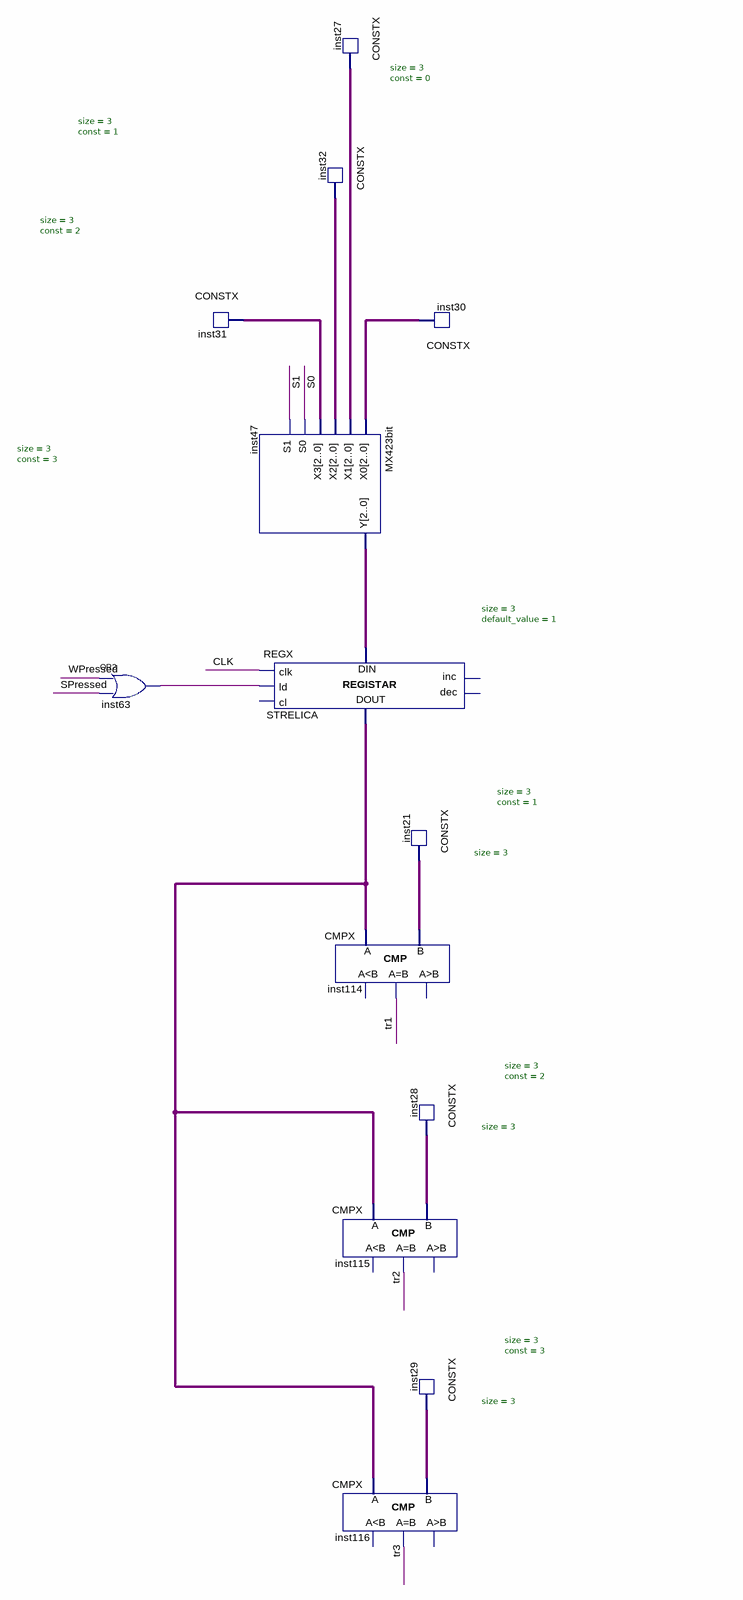
[diagram p0: schematic sheet]
// Quartus schematic ImplementacijaStreliceSema1.bdf as structural Verilog: 13 symbols, 0 pins
module ImplementacijaStreliceSema1 (
);

  wire CLK, inst63_out, S0, S1, SPressed, tr1, tr2, tr3, WPressed;
  wire [2:0] inst21_data, inst27_data, inst28_data, inst29_data, inst30_data, inst31_data, inst32_data,
       inst47_y, STRELICA_data_out;

  or inst63 (inst63_out, WPressed, SPressed);
  CONSTX #(.size(3), .\const (3)) inst31 (.data(inst31_data));
  MX423bit inst47 (
    .X0(inst30_data), .X1(inst27_data), .X2(inst32_data), .X3(inst31_data), .S0(S0), .S1(S1), .Y(inst47_y));
  REGX #(.size(3), .default_value(1)) STRELICA (
    .clk(CLK), .ld(inst63_out), .data_in(inst47_y), .data_out(STRELICA_data_out));  // open: cl, inc, dec
  CONSTX #(.size(3), .\const (2)) inst32 (.data(inst32_data));
  CMPX #(.size(3)) inst114 (.A(STRELICA_data_out), .B(inst21_data), .eq(tr1));  // open: ls, gr
  CONSTX #(.size(3), .\const (1)) inst27 (.data(inst27_data));
  CMPX #(.size(3)) inst115 (.A(STRELICA_data_out), .B(inst28_data), .eq(tr2));  // open: ls, gr
  CMPX #(.size(3)) inst116 (.A(STRELICA_data_out), .B(inst29_data), .eq(tr3));  // open: ls, gr
  CONSTX #(.size(3), .\const (0)) inst30 (.data(inst30_data));
  CONSTX #(.size(3), .\const (1)) inst21 (.data(inst21_data));
  CONSTX #(.size(3), .\const (2)) inst28 (.data(inst28_data));
  CONSTX #(.size(3), .\const (3)) inst29 (.data(inst29_data));
endmodule
